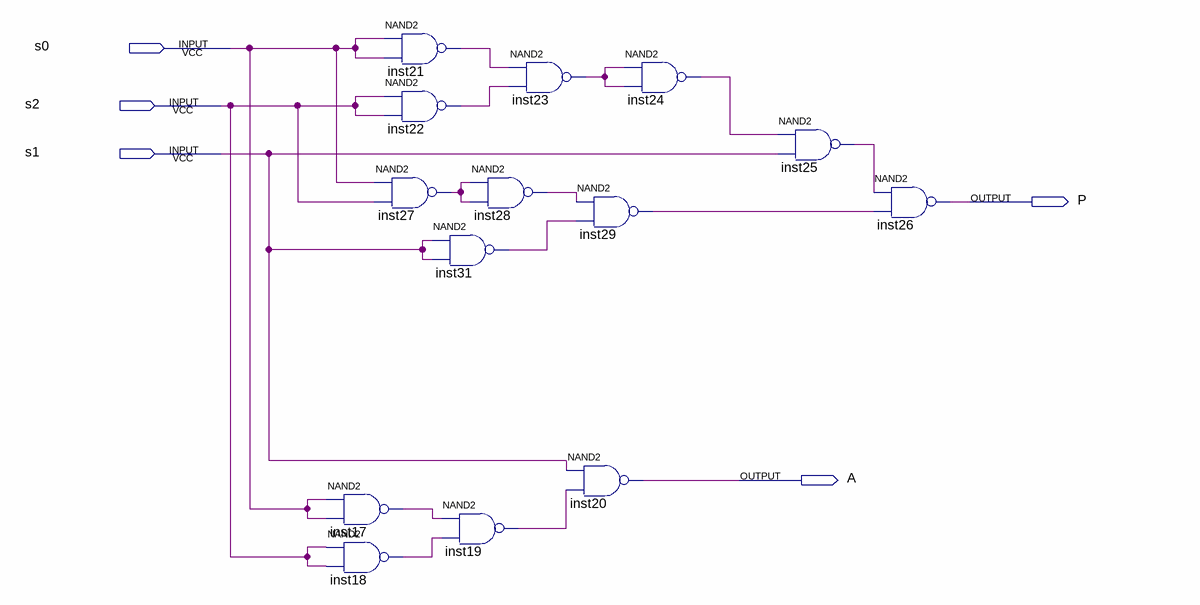
[diagram p0: schematic sheet]
// Quartus schematic Lab5DMG.bdf as structural Verilog: 14 symbols, 5 pins
module Lab5DMG (
  input  s0,
  input  s2,
  input  s1,
  output P,
  output A
);

  wire inst17_out, inst18_out, inst19_out, inst21_out, inst22_out, inst23_out, inst24_out, inst25_out,
       inst27_out, inst28_out, inst29_out, inst31_out;

  nand inst27 (inst27_out, s0, s2);
  nand inst17 (inst17_out, s0, s0);
  nand inst18 (inst18_out, s2, s2);
  nand inst21 (inst21_out, s0, s0);
  nand inst22 (inst22_out, s2, s2);
  nand inst31 (inst31_out, s1, s1);
  nand inst19 (inst19_out, inst17_out, inst18_out);
  nand inst23 (inst23_out, inst21_out, inst22_out);
  nand inst28 (inst28_out, inst27_out, inst27_out);
  nand inst29 (inst29_out, inst28_out, inst31_out);
  nand inst20 (A, s1, inst19_out);
  nand inst24 (inst24_out, inst23_out, inst23_out);
  nand inst25 (inst25_out, inst24_out, s1);
  nand inst26 (P, inst25_out, inst29_out);
endmodule
